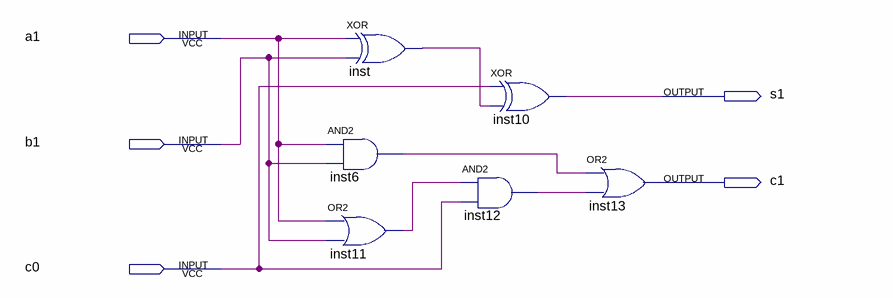
[diagram p0: schematic sheet]
// Quartus schematic My_Full_Adder.bdf as structural Verilog: 6 symbols, 5 pins
module My_Full_Adder (
  input  a1,
  input  b1,
  input  c0,
  output s1,
  output c1
);

  wire inst6_out, inst11_out, inst12_out, inst_out;

  and inst6 (inst6_out, a1, b1);
  or inst11 (inst11_out, a1, b1);
  xor inst (inst_out, a1, b1);
  and inst12 (inst12_out, inst11_out, c0);
  xor inst10 (s1, c0, inst_out);
  or inst13 (c1, inst6_out, inst12_out);
endmodule
